# EAGLE design probatio-arduino-shield - cópia (EAGLE 9.6.2)
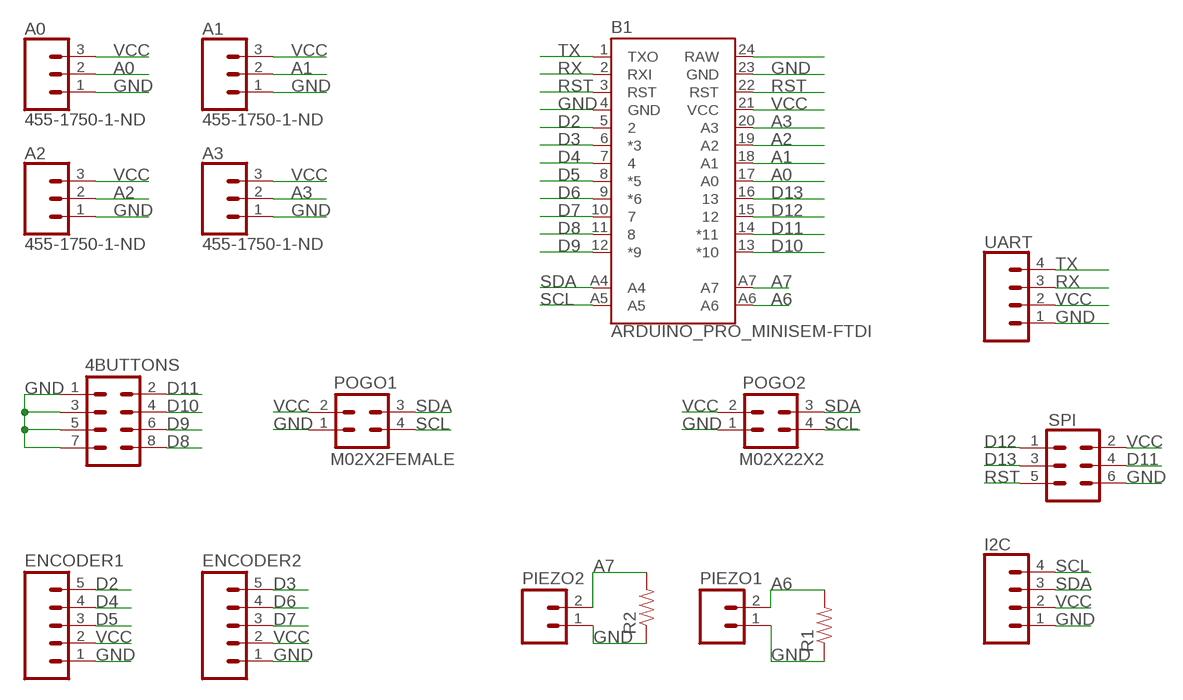
[diagram p0: schematic, sheet 1]

## Parts
4BUTTONS  M04X2  [2X4]
A0  455-1750-1-ND  CONN_03  [1X03]
A1  455-1750-1-ND  CONN_03  [1X03]
A2  455-1750-1-ND  CONN_03  [1X03]
A3  455-1750-1-ND  CONN_03  [1X03]
B1  ARDUINO_PRO_MINISEM-FTDI  [ARDUINO_PRO_MINI_S/FTDI]
ENCODER1  M05PTH  [1X05]
ENCODER2  M05PTH  [1X05]
I2C  CONN_04PTH  [1X04]
PIEZO1  M02PTH  [1X02]
PIEZO2  M02PTH  [1X02]
POGO1  M02X2FEMALE  [2X2INV]
POGO2  M02X22X2  [2X2]
R1  RESISTORPTH-1/4W  [AXIAL-0.4]
R2  RESISTORPTH-1/4W  [AXIAL-0.4]
SPI  CONN_03X2FEMALE  [2X3]
UART  CONN_04PTH  [1X04]

## Nets
A0: A0.2 B1.17(A0)
A1: A1.2 B1.18(A1)
A2: A2.2 B1.19(A2)
A3: A3.2 B1.20(A3)
A6: B1.A6 PIEZO1.2 R1.P$2
A7: B1.A7 PIEZO2.2 R2.P$2
D2: B1.5 ENCODER1.5
D3: B1.6(*3) ENCODER2.5
D4: B1.7 ENCODER1.4
D5: B1.8(*5) ENCODER1.3
D6: B1.9(*6) ENCODER2.4
D7: B1.10 ENCODER2.3
D8: 4BUTTONS.8 B1.11
D9: 4BUTTONS.6 B1.12(*9)
D10: 4BUTTONS.4 B1.13(*10)
D11: 4BUTTONS.2 B1.14(*11) SPI.4
D12: B1.15 SPI.1
D13: B1.16 SPI.3
GND: 4BUTTONS.1 4BUTTONS.3 4BUTTONS.5 4BUTTONS.7 A0.1 A1.1 A2.1 A3.1 B1.4(GND) B1.23(GND) ENCODER1.1 ENCODER2.1 I2C.1 PIEZO1.1 PIEZO2.1 POGO1.1 POGO2.1 R1.P$1 R2.P$1 SPI.6 UART.1
N$10: B1.24(RAW)
RST: B1.3(RST) B1.22(RST) SPI.5
RX: B1.2(RXI) UART.3
SCL: B1.A5 I2C.4 POGO1.4 POGO2.4
SDA: B1.A4 I2C.3 POGO1.3 POGO2.3
TX: B1.1(TXO) UART.4
VCC: A0.3 A1.3 A2.3 A3.3 B1.21(VCC) ENCODER1.2 ENCODER2.2 I2C.2 POGO1.2 POGO2.2 SPI.2 UART.2

## Library data of the parts
4BUTTONS = Batebit:M04X2: .1" header, two rows of four.
A0 A1-A3 = Batebit:CONN_03: Multi connection point. Often used as Generic Header-pin footprint for 0.1 inch spaced/style header connections On any of the 0.1 inch spaced packages, you can populate with these: Break Away Headers - Straight <https://www.sparkfun.com/products/116> (PRT-00116) Break Away Male Headers - Right Angle <https://www.sparkfun.com/products/553> (PRT-00553) Female Headers <https://www.sparkfun.com/products/115> (PRT-00115) Break Away Headers - Machine Pin <https://www.sparkfun.com/products/117> (PRT-00117) Break Away Female Headers - Swiss Machine Pin <https://www.sparkfun.com/products/743> (PRT-00743) Stackable Header - 3 Pin (Female, 0.1") <https://www.sparkfun.com/products/13875> (PRT-13875) For SCREWTERMINALS and SPRING TERMINALS visit here: Screw Terimnals on SparkFun.com <https://www.sparkfun.com/search/results?term=Screw+Terminals> (5mm/3.5mm/2.54mm spacing) This device is also useful as a general connection point to wire up your design to another part of your project. Our various solder wires solder well into these plated through hole pads. Hook-Up Wire - Assortment (Stranded, 22 AWG) <https://www.sparkfun.com/products/11375> (PRT-11375) Hook-Up Wire - Assortment (Solid Core, 22 AWG) <https://www.sparkfun.com/products/11367> (PRT-11367) View the entire wire category on our website here <https://www.sparkfun.com/categories/141> Special notes: Molex polarized connector foot print use with SKU : PRT-08232 with associated crimp pins and housings.; PROD_ID: XXX-00000
B1 = Batebit:ARDUINO_PRO_MINI: SparkFun Pro Mini Pro Mini compatible footprint. Dimensions: 0.7 x 1.3" PCB Thickness: 0.8mm SparkFun Products: 3.3V/8MHz <https://www.sparkfun.com/products/11114> 5V/16MHz <https://www.sparkfun.com/products/11113>
ENCODER1 ENCODER2 = Batebit:M05: Header 5 Standard 5-pin 0.1" header. Use with straight break away headers (SKU : PRT-00116), right angle break away headers (PRT-00553), swiss pins (PRT-00743), machine pins (PRT-00117), and female headers (PRT-00115). Molex polarized connector foot print use with SKU : PRT-08230 with associated crimp pins and housings.
I2C UART = Batebit:CONN_04: Multi connection point. Often used as Generic Header-pin footprint for 0.1 inch spaced/style header connections On any of the 0.1 inch spaced packages, you can populate with these: Break Away Headers - Straight <https://www.sparkfun.com/products/116> (PRT-00116) Break Away Male Headers - Right Angle <https://www.sparkfun.com/products/553> (PRT-00553) Female Headers <https://www.sparkfun.com/products/115> (PRT-00115) Break Away Headers - Machine Pin <https://www.sparkfun.com/products/117> (PRT-00117) Break Away Female Headers - Swiss Machine Pin <https://www.sparkfun.com/products/743> (PRT-00743) For SCREWTERMINALS and SPRING TERMINALS visit here: Screw Terimnals on SparkFun.com <https://www.sparkfun.com/search/results?term=Screw+Terminals> (5mm/3.5mm/2.54mm spacing) This device is also useful as a general connection point to wire up your design to another part of your project. Our various solder wires solder well into these plated through hole pads. Hook-Up Wire - Assortment (Stranded, 22 AWG) <https://www.sparkfun.com/products/11375> (PRT-11375) Hook-Up Wire - Assortment (Solid Core, 22 AWG) <https://www.sparkfun.com/products/11367> (PRT-11367) View the entire wire category on our website here <https://www.sparkfun.com/categories/141> Special notes: Molex polarized connector foot print use with SKU : PRT-08231 with associated crimp pins and housings. 1MM SMD Version SKU: PRT-10208; PROD_ID: CONN-09696
PIEZO1 PIEZO2 = Batebit:M02: Standard 2-pin 0.1" header. Use with - straight break away headers ( PRT-00116) - right angle break away headers (PRT-00553) - swiss pins (PRT-00743) - machine pins (PRT-00117) - female headers (PRT-00115) Molex polarized connector foot print use with: PRT-08233 with associated crimp pins and housings. 2.54_SCREWTERM for use with PRT-10571. 3.5mm Screw Terminal footprints for PRT-08084 5mm Screw Terminal footprints for use with PRT-08432
POGO1 POGO2 = Batebit:M02X2
R1 R2 = Batebit:RESISTOR: Resistor Basic schematic elements and footprints for 0603, 1206, and PTH resistors.
SPI = Batebit:CONN_03X2: Multi connection point. Often used as Generic Header-pin footprint for 0.1 inch spaced/style header connections You can populate with any combo of single row headers, but if you'd like an exact match, check these: Header - 2x3 (Male, 0.1") <https://www.sparkfun.com/products/12807> (PRT-12807) Header - 2x3 (Female, 0.1") <https://www.sparkfun.com/products/13010> (PRT-13010) 2x3 Pin Shrouded Header <https://www.sparkfun.com/products/10877> (PRT-10877) On any of the 0.1 inch spaced packages, you can populate with these: Break Away Headers - Straight <https://www.sparkfun.com/products/116> (PRT-00116) Break Away Male Headers - Right Angle <https://www.sparkfun.com/products/553> (PRT-00553) Female Headers <https://www.sparkfun.com/products/115> (PRT-00115) Break Away Headers - Machine Pin <https://www.sparkfun.com/products/117> (PRT-00117) Break Away Female Headers - Swiss Machine Pin <https://www.sparkfun.com/products/743> (PRT-00743) Special note: the shrouded connector mates well with our 3x2 ribbon cables: Ribbon Crimp Connector - 6-pin (2x3, Female) <https://www.sparkfun.com/products/10651> (PRT-10651) Ribbon Cable - 6 wire (15ft) <https://www.sparkfun.com/products/10646> (PRT-10646); PROD_ID: CONN-11566; VALUE: FEMALE 2x3

## Net classes
0 default: width 0.254 mm, drill 0.508 mm, clearance 0.127 mm

## Board
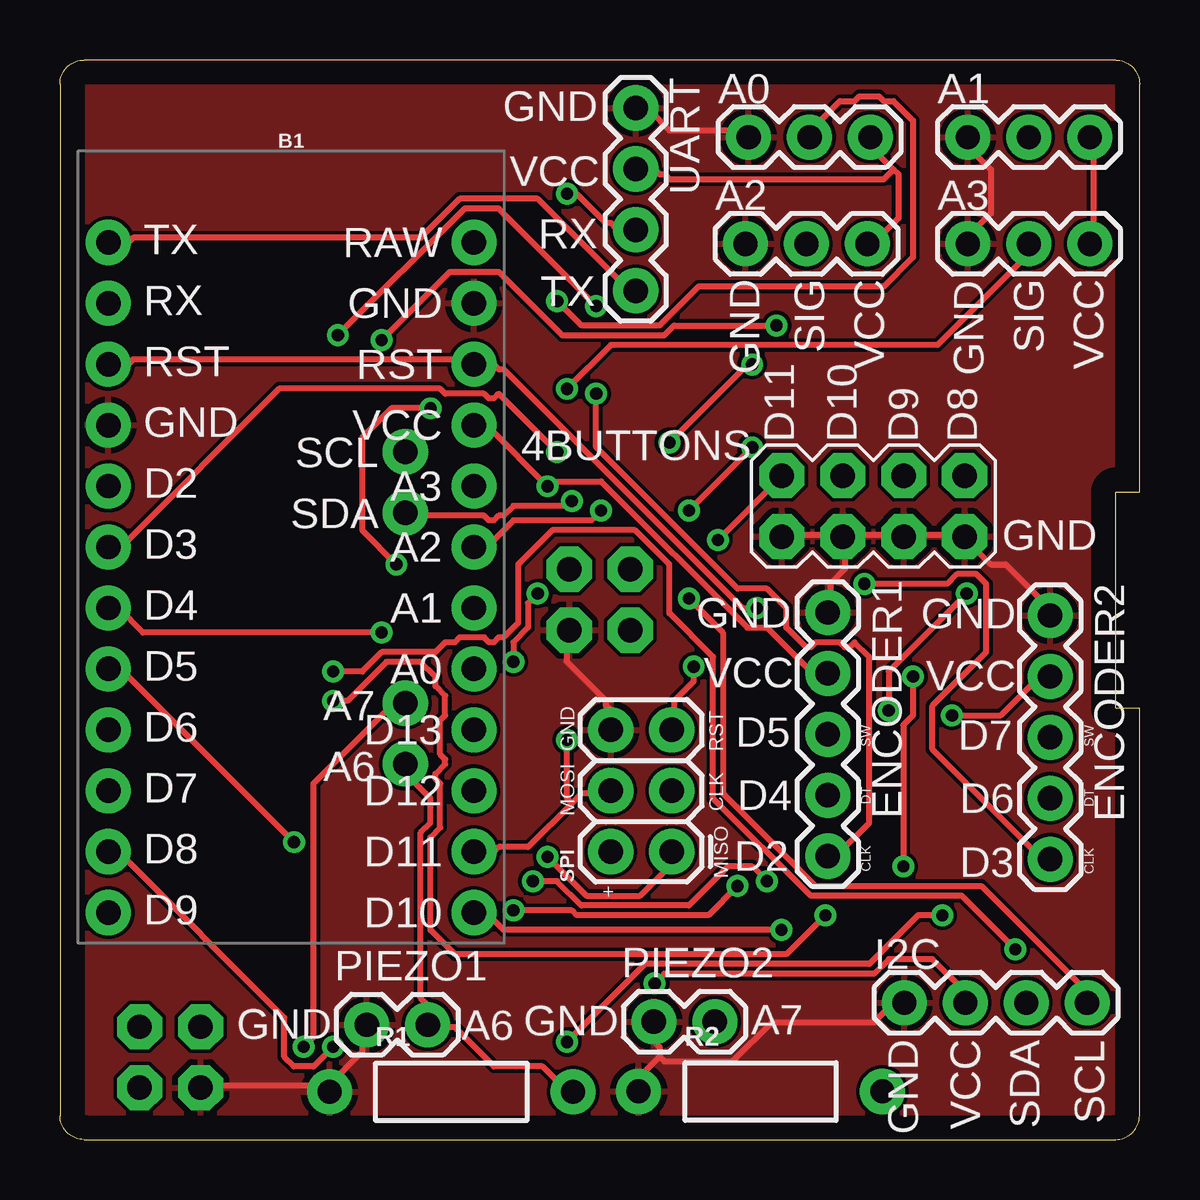
[diagram p1: board, top side]
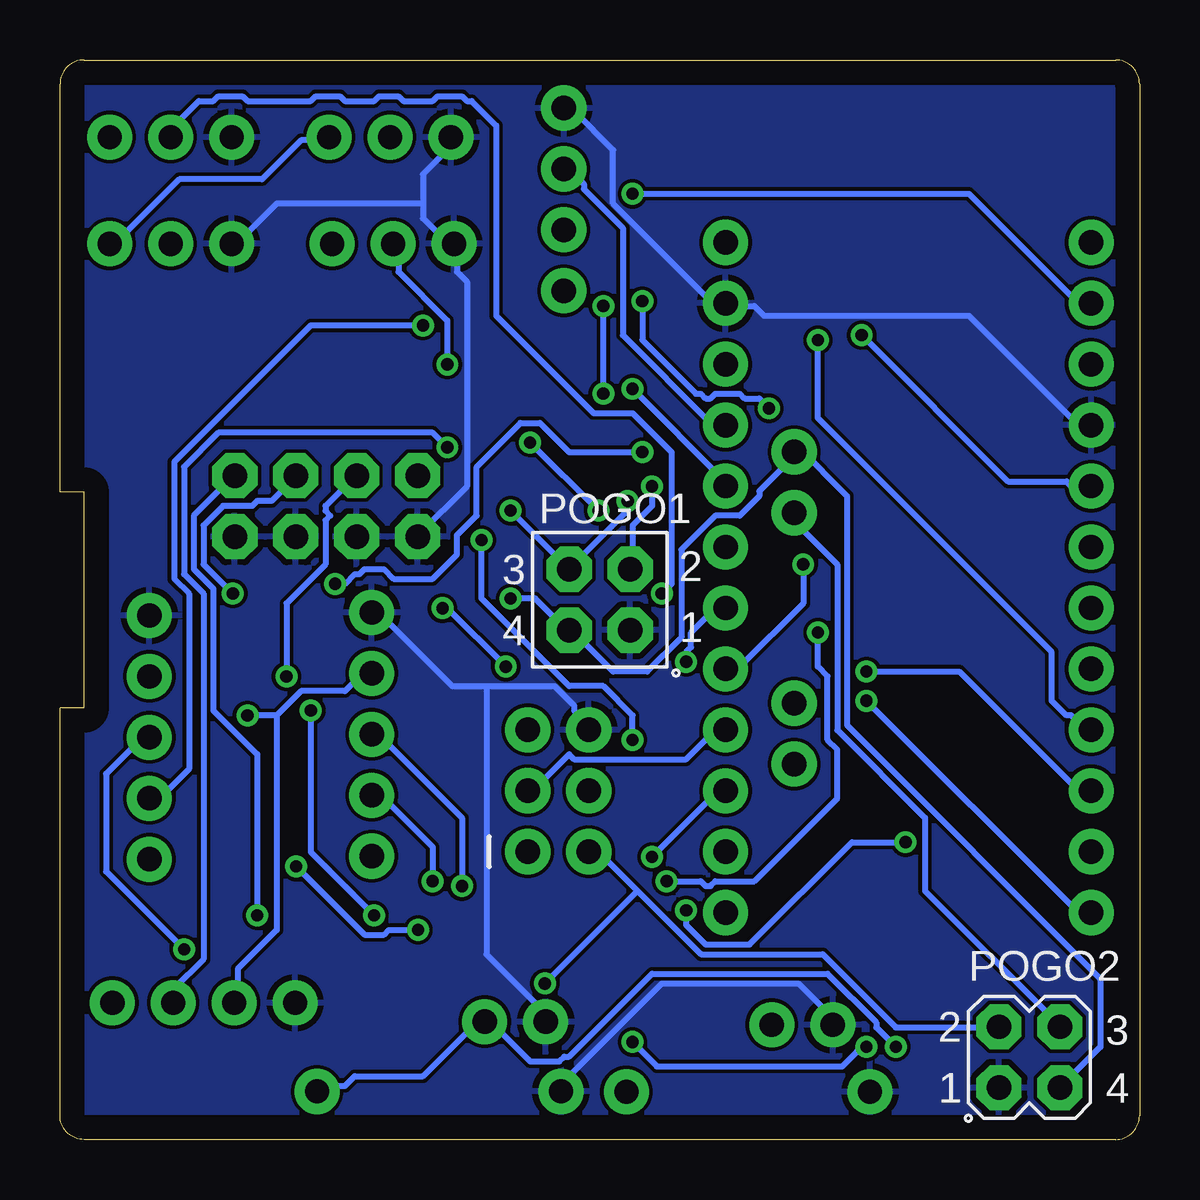
[diagram p2: board, bottom side, seen from below]

Size 45 x 45 mm. Coordinates in mm from the lower left corner, seen from the top.
Outline: 1,0 44,0 arc90 45,1 45,18 44,18 44,27 45,27 45,44 arc90 44,45 1,45 arc90 0,44 0,1 arc90 1,0
Copper layers (1*16): Top 0.035mm / dielectric 1.5mm / Bottom 0.035mm
Design rules "default": minimum track width 6mil, minimum drill 0.35mm, track to track 6mil, track to pad 6mil, pad to pad 6mil, via to via 6mil, smd to smd 6mil, copper to edge 40mil, drill to drill 6mil, minimum pad ring 10mil, minimum via ring 8mil, stop-mask expansion 4mil, vias tented up to drill 0mil, thermal gap 10mil

### Footprints (pad centres in the part's own frame; a part is rotated, then mirrored left to right if it is on the bottom)
2X4 = drill 1.016 pad 1.88 octagon: 1 -3.81,-1.27; 2 -3.81,1.27; 3 -1.27,-1.27; 4 -1.27,1.27; 5 1.27,-1.27; 6 1.27,1.27; 7 3.81,-1.27; 8 3.81,1.27
1X03 = drill 1.016 pad 1.88: 1 0,0; 2 2.54,0; 3 5.08,0
ARDUINO_PRO_MINI_S/FTDI = drill 1.016 pad 1.88: 1 -7.62,12.7; 2 -7.62,10.16; 3 -7.62,7.62; 4 -7.62,5.08; 5 -7.62,2.54; 6 -7.62,0; 7 -7.62,-2.54; 8 -7.62,-5.08; 9 -7.62,-7.62; 10 -7.62,-10.16; 11 -7.62,-12.7; 12 -7.62,-15.24; 13 7.62,-15.24; 14 7.62,-12.7; 15 7.62,-10.16; 16 7.62,-7.62; 17 7.62,-5.08; 18 7.62,-2.54; 19 7.62,0; 20 7.62,2.54; 21 7.62,5.08; 22 7.62,7.62; 23 7.62,10.16; 24 7.62,12.7; A4 4.763,1.429; A5 4.763,3.969; A6 4.763,-9.049; A7 4.763,-6.509
1X05 = drill 1.016 pad 1.88: 1 0,0; 2 2.54,0; 3 5.08,0; 4 7.62,0; 5 10.16,0
1X04 = drill 1.016 pad 1.88: 1 0,0; 2 2.54,0; 3 5.08,0; 4 7.62,0
1X02 = drill 1.016 pad 1.88: 1 0,0; 2 2.54,0
2X2INV = drill 1.016 pad 1.88 octagon: 1 1.27,-1.27; 2 1.27,1.27; 3 -1.27,1.27; 4 -1.27,-1.27
2X2 = drill 1.016 pad 1.88 octagon: 1 -1.27,-1.27; 2 -1.27,1.27; 3 1.27,1.27; 4 1.27,-1.27
AXIAL-0.4 = drill 1 pad 1.88: P$1 -5.08,0; P$2 5.08,0
2X3 = drill 1.016 pad 1.88: 1 0,0; 2 0,2.54; 3 2.54,0; 4 2.54,2.54; 5 5.08,0; 6 5.08,2.54

### Placement (x,y rotation side)
4BUTTONS  33.9,26.4 0 top
A0  28.7,41.78 0 top
A1  37.85,41.78 0 top
A2  28.57,37.34 0 top
A3  37.85,37.34 0 top
B1  9.63,24.7 0 top
ENCODER1  32,21.97 270 top
ENCODER2  41.27,21.84 270 top
I2C  35.2,5.7 0 top
PIEZO1  12.79,4.78 0 top
PIEZO2  24.76,4.91 0 top
POGO1  22.5,22.5 0 bottom
POGO2  4.59,3.43 0 bottom
R1  16.31,1.99 0 top
R2  29.2,2 0 top
SPI  25.5,12 90 top
UART  24,43 270 top

### Tracks (layer width: path | path; a pad name or v marks a point on that pad's centre or on a via)
A0  (via drill 0.51)
  Top 0.254: v14.02,23.98 12.6,25.4 12.6,29.26 13.82,30.48 v15.44,30.48 | v20.73,34.95 21.74,33.93 24.99,33.93 26.62,35.56 34.34,35.56 35.56,36.78 35.56,42.47 34.75,43.28 34.34,43.28 34.14,43.48 33.33,43.48 33.12,43.28 32.51,43.28 31.09,41.86 A0.2
  Bottom 0.254: v14.02,23.98 14.02,22.35 16.66,19.71 17.07,19.71 B1.17 | v15.44,30.48 15.85,30.89 16.46,30.89 16.66,31.09 17.68,31.09 17.88,30.89 18.09,30.89 18.29,31.09 18.49,31.09 20.73,33.33 v20.73,34.95
A1  (via drill 0.51)
  Top 0.254: v18.9,19.91 18.9,20.73 19.51,21.34 19.51,22.35 v19.91,22.76
  Bottom 0.254: v18.9,19.91 18.9,20.32 18.69,20.52 18.69,21.13 17.68,22.15 17.27,22.15 B1.18 | v19.91,22.76 19.51,23.16 19.51,28.65 21.13,30.28 22.76,30.28 26.82,34.34 26.82,42.27 27.84,43.28 28.04,43.28 28.25,43.48 29.26,43.48 29.46,43.28 30.68,43.28 30.89,43.48 31.7,43.48 31.9,43.28 33.12,43.28 33.33,43.48 34.34,43.48 34.54,43.28 37.19,43.28 37.39,43.48 38.41,43.48 38.61,43.28 39.22,43.28 40.23,42.27 40.23,41.86 A1.2
A2  (via drill 0.51)
  Top 0.254: v22.55,26.21 22.15,25.81 18.9,25.81 17.88,24.79 17.27,24.79 B1.19 | v25.4,29.06 28.65,32.31 v28.85,32.31
  Bottom 0.254: v25.4,29.06 v22.55,26.21 | v28.85,32.31 28.85,34.14 30.89,36.17 30.89,36.98 31.09,37.19 A2.2
A3  (via drill 0.51)
  Top 0.254: v21.13,31.29 22.96,33.12 36.58,33.12 40.23,36.78 40.23,37.19 A3.2
  Bottom 0.254: v21.13,31.29 17.27,27.43 B1.20
A6
  Top 0.254: R1.P$2 21.34,1.83 20.12,3.05 18.09,3.05 16.46,4.67 15.44,4.67 PIEZO1.2 15.24,4.88 15.24,5.69 15.04,5.89 15.04,12.8 15.44,13.21 15.44,14.22 14.43,15.24 14.43,15.65 B1.A6
A7  (via drill 0.51)
  Top 0.254: v10.16,3.86 10.57,4.27 10.57,14.83 13.82,18.09 14.22,18.09 B1.A7
  Bottom 0.254: R2.P$2 34.14,2.03 33.93,2.23 33.12,2.23 32.72,2.64 29.87,2.64 28.04,4.47 27.84,4.47 27.43,4.88 PIEZO2.2 27.23,5.08 25.4,3.25 24.18,3.25 23.98,3.45 23.77,3.45 20.32,6.91 13.01,6.91 10.97,4.88 10.97,4.67 v10.16,3.86
D2  (via drill 0.51)
  Top 0.254: v11.58,33.53 16.87,38.81 18.29,38.81 v22.35,34.75 | v22.35,31.09 22.35,28.85 28.25,22.96 29.46,22.96 30.28,22.15 30.28,21.34 31.09,20.52 31.29,20.52 31.5,20.73 32.51,20.73 32.72,20.52 32.92,20.52 33.12,20.73 33.73,20.12 33.73,13.21 32.51,11.99 32.11,11.99 ENCODER1.5
  Bottom 0.254: v11.58,33.53 5.49,27.43 3.05,27.43 2.85,27.23 2.03,27.23 B1.5 | v22.35,31.09 v22.35,34.75
D3  (via drill 0.51)
  Top 0.254: v20.73,28.65 18.29,31.09 18.09,30.89 17.88,30.89 17.68,31.09 16.05,31.09 15.85,31.29 9.14,31.29 2.64,24.79 2.03,24.79 B1.6 | v33.53,23.16 36.98,23.16 37.39,23.57 38.2,23.57 38.61,23.16 38.61,20.32 36.37,18.09 36.37,16.26 40.84,11.79 41.25,11.79 ENCODER2.5
  Bottom 0.254: v20.73,28.65 23.77,28.65 24.99,29.87 25.81,29.87 27.64,28.04 27.64,26.01 28.45,25.2 28.45,24.38 29.46,23.37 31.09,23.37 31.5,23.77 32.31,23.77 32.51,23.57 32.72,23.57 33.12,23.16 v33.53,23.16
D4  (via drill 0.51)
  Top 0.254: v13.41,21.13 3.45,21.13 2.44,22.15 2.03,22.15 B1.7 | v19.71,10.77 20.73,10.77 21.74,9.75 26.21,9.75 27.84,11.38 28.85,11.38 v29.46,10.77
  Bottom 0.254: v13.41,21.13 13.41,19.71 13.01,19.3 13.01,16.66 12.6,16.26 12.6,14.22 16.05,10.77 17.68,10.77 17.88,10.57 18.09,10.57 18.29,10.77 v19.71,10.77 | v29.46,10.77 29.46,12.19 31.5,14.22 31.9,14.22 ENCODER1.4
D5  (via drill 0.51)
  Top 0.254: v9.75,12.39 2.64,19.51 2.03,19.51 B1.8 | v18.9,9.55 21.34,9.55 21.54,9.35 27.03,9.35 v28.25,10.57
  Bottom 0.254: v9.75,12.39 11.99,12.39 16.26,8.13 18.09,8.13 18.9,8.94 v18.9,9.55 | v28.25,10.57 28.25,13.41 31.9,17.07 ENCODER1.3
D6  (via drill 0.51)
  Top 0.254: v29.87,33.93 25.6,33.93 25.2,33.53 20.93,33.53 18.29,36.17 16.26,36.17 v13.41,33.33
  Bottom 0.254: ENCODER2.4 40.84,14.22 39.62,15.44 39.62,22.76 40.23,23.37 40.23,28.25 34.54,33.93 v29.87,33.93 | v13.41,33.33 13.41,30.07 3.66,20.32 3.66,18.29 3.05,17.68 2.85,17.68 2.44,17.27 2.03,17.27 B1.9
D7  (via drill 0.51)
  Top 0.254: v11.38,19.51 12.6,19.51 13.41,20.32 15.65,20.32 16.05,20.73 16.46,20.73 16.66,20.93 17.68,20.93 17.88,20.73 18.09,20.73 18.29,20.93 18.49,20.93 19.1,21.54 19.1,23.98 20.52,25.4 23.98,25.4 25.4,23.98 25.4,21.95 27.23,20.12 27.23,14.22 31.29,10.16 37.59,10.16 v39.83,7.92
  Bottom 0.254: v11.38,19.51 7.52,19.51 2.64,14.63 2.03,14.63 B1.10 | v39.83,7.92 43.08,11.18 43.08,15.24 41.45,16.87 ENCODER2.3
D8  (via drill 0.51)
  Top 0.254: v11.38,3.86 10.57,3.05 9.75,3.05 9.35,3.45 9.35,5.08 2.44,11.99 2.03,11.99 B1.11 | v21.13,4.06 24.38,7.32 33.73,7.32 35.76,9.35 v36.78,9.35
  Bottom 0.254: v11.38,3.86 11.58,3.66 11.79,3.66 12.39,3.05 20.12,3.05 v21.13,4.06 | v36.78,9.35 36.78,16.05 38.61,17.88 38.61,22.96 39.42,23.77 39.42,26.01 37.8,27.64 4BUTTONS.8
D9  (via drill 0.51)
  Top 0.254: v11.38,18.29 11.99,18.29 13.61,19.91 15.04,19.91 15.65,19.3 15.65,18.9 16.05,18.49 16.05,17.68 15.85,17.48 15.85,16.05 16.05,15.85 16.05,15.65 15.65,15.24 15.65,15.04 15.85,14.83 15.85,13.01 15.44,12.6 15.44,8.74 16.46,7.72 30.28,7.72 v31.9,9.35 | v34.54,17.88 34.54,19.51 v37.8,22.76
  Bottom 0.254: v11.38,18.29 2.64,9.55 2.03,9.55 B1.12 | v31.9,9.35 34.54,11.99 v34.54,17.88 | v37.8,22.76 39.01,23.98 39.01,25.6 38.2,26.42 36.98,26.42 36.78,26.62 36.17,26.62 35.15,27.64 4BUTTONS.6
D10  (via drill 0.51)
  Top 0.254: v30.07,8.74 18.49,8.74 17.88,9.35 17.27,9.35 B1.13 | v35.15,11.38 35.15,17.27 35.56,17.68 v35.56,19.3
  Bottom 0.254: v30.07,8.74 31.29,8.74 31.5,8.53 32.31,8.53 v35.15,11.38 | v35.56,19.3 35.56,22.35 33.93,23.98 33.93,25.81 33.73,26.01 33.93,26.21 33.93,26.42 32.72,27.64 4BUTTONS.4
D11  (via drill 0.51)
  Top 0.254: 21.34,14.02 21.74,14.43 22.76,14.43 SPI.4 | 21.34,14.02 19.51,12.19 18.29,12.19 18.09,11.99 17.27,11.99 B1.14 | v27.43,24.99 30.07,27.64 4BUTTONS.2 | v21.13,16.66 21.13,14.22 21.34,14.02
  Bottom 0.254: v27.43,24.99 27.43,22.55 23.77,18.9 22.35,18.9 21.13,17.68 v21.13,16.66
D12  (via drill 0.51)
  Top 0.254: v20.32,11.79 21.95,10.16 24.18,10.16 25.4,11.38 25.4,11.99 SPI.1
  Bottom 0.254: v20.32,11.79 17.68,14.43 17.27,14.43 B1.15
D13
  Bottom 0.254: B1.16 17.27,17.07 17.68,17.07 18.9,15.85 23.57,15.85 23.77,16.05 25.4,14.43 SPI.3
GND
  Top 0.254: 11.38,2.23 11.38,2.44 12.6,3.66 12.6,4.67 PIEZO1.1 | 11.38,2.23 11.38,2.03 R1.P$1 11.38,2.23 | 11.38,2.23 5.89,2.23 POGO2.1 | 24.99,3.45 24.18,2.64 24.18,2.03 R2.P$1 | 24.99,3.45 24.99,3.86 24.79,4.06 24.79,4.88 PIEZO2.1 | 24.99,3.45 25.2,3.25 28.04,3.25 29.67,4.88 33.93,4.88 34.75,5.69 35.15,5.69 I2C.1 | POGO1.1 21.13,21.13 21.13,19.91 22.76,18.29 22.76,18.09 22.96,17.88 22.96,17.27 SPI.6 | 4BUTTONS.1 30.28,25.2 32.51,25.2 4BUTTONS.3 | ENCODER1.1 32.11,22.15 32.11,23.16 32.72,23.77 32.72,24.99 4BUTTONS.3 | ENCODER2.1 41.25,21.95 40.84,22.35 40.84,22.55 39.42,23.98 38.81,23.98 37.8,24.99 4BUTTONS.7 37.59,25.2 35.36,25.2 4BUTTONS.5 35.15,25.2 32.72,25.2 4BUTTONS.3 | A3.1 38,37.39 38,37.8 38.81,38.61 38.81,40.44 38,41.25 38,41.66 A1.1 | UART.1 24.18,42.88 24.59,42.88 25.4,42.06 28.45,42.06 28.65,41.86 A0.1
  Bottom 0.254: PIEZO1.1 12.8,4.88 13.21,5.28 13.21,5.49 14.22,6.5 19.91,6.5 23.98,2.44 23.98,2.03 R2.P$1 | 27.23,18.9 28.65,18.9 31.9,22.15 ENCODER1.1 | 27.23,18.9 24.38,18.9 23.57,18.09 23.57,17.88 22.96,17.27 SPI.6 | 29.87,39.01 29.87,40.23 28.85,41.25 28.85,41.66 A0.1 | 29.87,39.01 29.87,38.41 29.26,37.8 29.06,37.8 28.65,37.39 A2.1 28.45,37.19 28.45,36.17 28.04,35.76 28.04,27.23 30.07,25.2 4BUTTONS.1 | A3.1 37.39,37.8 37.19,37.8 35.97,39.01 29.87,39.01 | B1.4 2.03,29.87 2.64,29.87 7.11,34.34 15.65,34.34 16.05,34.75 17.07,34.75 B1.23 17.27,34.95 17.88,34.95 21.95,39.01 21.95,41.25 23.57,42.88 23.98,42.88 UART.1 | 27.23,18.9 27.23,7.72 25.2,5.69 25.2,5.49 24.79,5.08 PIEZO2.1
  pour Top (isolate 0.127): 0,44 1,45 44,45 45,44 45,1 44,0 1,0 0,1
  pour Bottom (isolate 0.127): 0,1 0,44 1,45 44,45 45,44 45,1 44,0 1,0
RST  (via drill 0.51)
  Top 0.254: B1.3 2.03,32.31 2.85,32.31 3.05,32.51 17.07,32.51 B1.22 17.27,32.31 18.09,32.31 18.29,32.11 18.49,32.11 28.45,22.15 v29.06,22.15 | v26.42,19.71 26.42,19.1 25.6,18.29 25.6,17.27 SPI.5
  Bottom 0.254: v26.42,19.71 28.85,22.15 v29.06,22.15
RX  (via drill 0.51)
  Top 0.254: v21.13,39.42 21.54,39.42 22.76,38.2 22.96,38.2 23.16,38 23.98,38 UART.3
  Bottom 0.254: v21.13,39.42 7.11,39.42 2.64,34.95 2.03,34.95 B1.2
SCL  (via drill 0.51)
  Top 0.254: v26.21,22.55 27.64,21.13 27.64,14.43 31.5,10.57 38.41,10.57 42.67,6.3 42.67,5.89 I2C.4
  Bottom 0.254: POGO2.4 3.25,2.23 1.63,3.86 1.63,6.71 12.19,17.27 12.19,26.82 14.22,28.85 B1.A5 14.22,28.65 15.85,27.03 15.85,26.82 16.66,26.01 17.68,26.01 19.1,24.59 19.1,20.93 20.52,19.51 21.95,19.51 23.57,21.13 POGO1.4 23.77,21.13 25.2,22.55 v26.21,22.55
SDA  (via drill 0.51)
  Top 0.254: v26.21,26.21 v28.85,28.85 | v21.34,26.62 21.13,26.42 18.9,26.42 18.49,26.01 18.29,26.01 18.09,25.81 17.88,25.81 17.68,26.01 14.43,26.01 B1.A4
  Bottom 0.254: POGO2.3 3.45,4.88 8.94,10.36 8.94,13.41 12.6,17.07 12.6,23.98 14.22,25.6 14.22,26.01 B1.A4 | v28.85,28.85 29.46,29.46 38.41,29.46 39.83,28.04 39.83,23.57 39.01,22.76 39.01,7.52 40.23,6.3 40.23,5.89 I2C.3 | POGO1.3 v26.21,26.21 | v21.34,26.62 21.34,26.21 POGO1.3 | POGO1.3
TX
  Top 0.254: B1.1 2.03,37.39 2.85,37.39 3.05,37.59 15.04,37.59 16.66,39.22 19.91,39.22 23.57,35.56 23.98,35.56 UART.4
VCC  (via drill 0.51)
  Top 0.254: A3.3 43.08,37.39 43.08,41.66 A1.3 | 34.75,40.44 33.93,41.25 33.93,41.66 A0.3 | 34.75,40.44 34.95,40.23 34.95,38.41 34.34,37.8 34.14,37.8 33.73,37.39 A2.3 | B1.21 17.27,29.67 17.88,29.67 v20.32,27.23 20.52,27.43 22.55,27.43 28.65,21.34 29.46,21.34 31.29,19.51 31.9,19.51 ENCODER1.2 | ENCODER2.2 40.84,19.3 39.22,17.68 v37.19,17.68 | 34.75,40.44 34.34,40.03 25.4,40.03 25.2,40.23 24.99,40.23 24.79,40.44 24.18,40.44 UART.2 | v24.79,6.5 25.2,6.91 33.93,6.91 34.54,7.52 36.37,7.52 37.59,6.3 37.59,5.89 I2C.2
  Bottom 0.254: 20.93,10.36 22.76,12.19 SPI.2 | 20.93,10.36 18.29,7.72 13.21,7.72 10.16,4.67 5.89,4.67 POGO2.2 | A3.3 42.47,37.8 42.27,37.8 40.03,40.03 36.58,40.03 34.95,41.66 33.93,41.66 A0.3 | B1.21 17.27,29.87 17.88,29.87 21.54,33.53 21.54,38 23.16,39.62 23.16,39.83 23.98,40.64 UART.2 | v20.32,27.23 20.32,26.42 21.13,25.6 21.13,23.77 POGO1.2 | 35.97,17.68 35.97,8.74 37.59,7.11 37.59,5.89 I2C.2 | 35.97,17.68 34.95,18.69 33.12,18.69 32.51,19.3 32.11,19.3 ENCODER1.2 | 35.97,17.68 v37.19,17.68 | v24.79,6.5 20.93,10.36

### Text on the board
tPlace: GND | VCC | RAW | RX | TX | GND | TX | GND | SIG | VCC | GND | SIG | VCC | RX | RST | RST | VCC | GND | SCL | D11 | D10 | D9 | D8 | A3 | D2 | SDA | A2 | GND | D3 | A1 | GND | GND | D4 | A0 | VCC | VCC | D5 | A7 | D13 | D5 | D6 | D7 | A6 | GND | RST | SW | SW | D12 | D4 | D6 | D7 | CLK | DT | DT | D11 | MOSI | D2 | D3 | D8 | MISO | CLK | CLK | D10 | + | D9 | GND | GND | A6 | A7 | GND | VCC | SDA | SCL